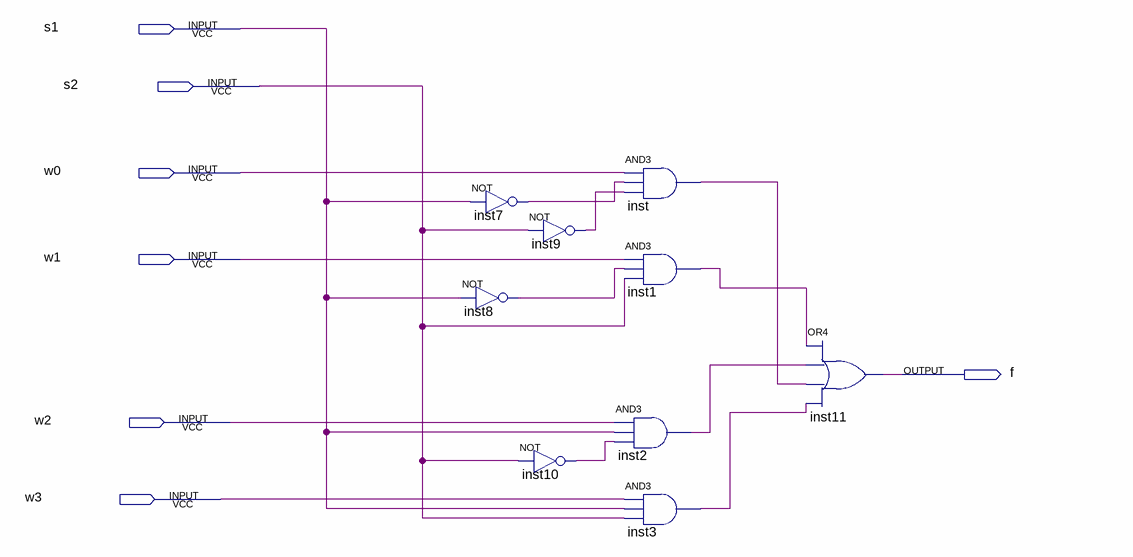
[diagram p0: schematic sheet]
// Quartus schematic func.bdf as structural Verilog: 9 symbols, 7 pins
module func (
  input  s1,
  input  s2,
  input  w0,
  input  w1,
  input  w2,
  input  w3,
  output f
);

  wire inst1_out, inst2_out, inst3_out, inst7_out, inst8_out, inst9_out, inst10_out, inst_out;

  not inst7 (inst7_out, s1);
  not inst8 (inst8_out, s1);
  not inst9 (inst9_out, s2);
  not inst10 (inst10_out, s2);
  and inst (inst_out, w0, inst7_out, inst9_out);
  and inst1 (inst1_out, w1, inst8_out, s2);
  and inst2 (inst2_out, w2, s1, inst10_out);
  and inst3 (inst3_out, w3, s1, s2);
  or inst11 (f, inst1_out, inst2_out, inst_out, inst3_out);
endmodule
